# Altium schematic sheet Power.SchDoc
size A4
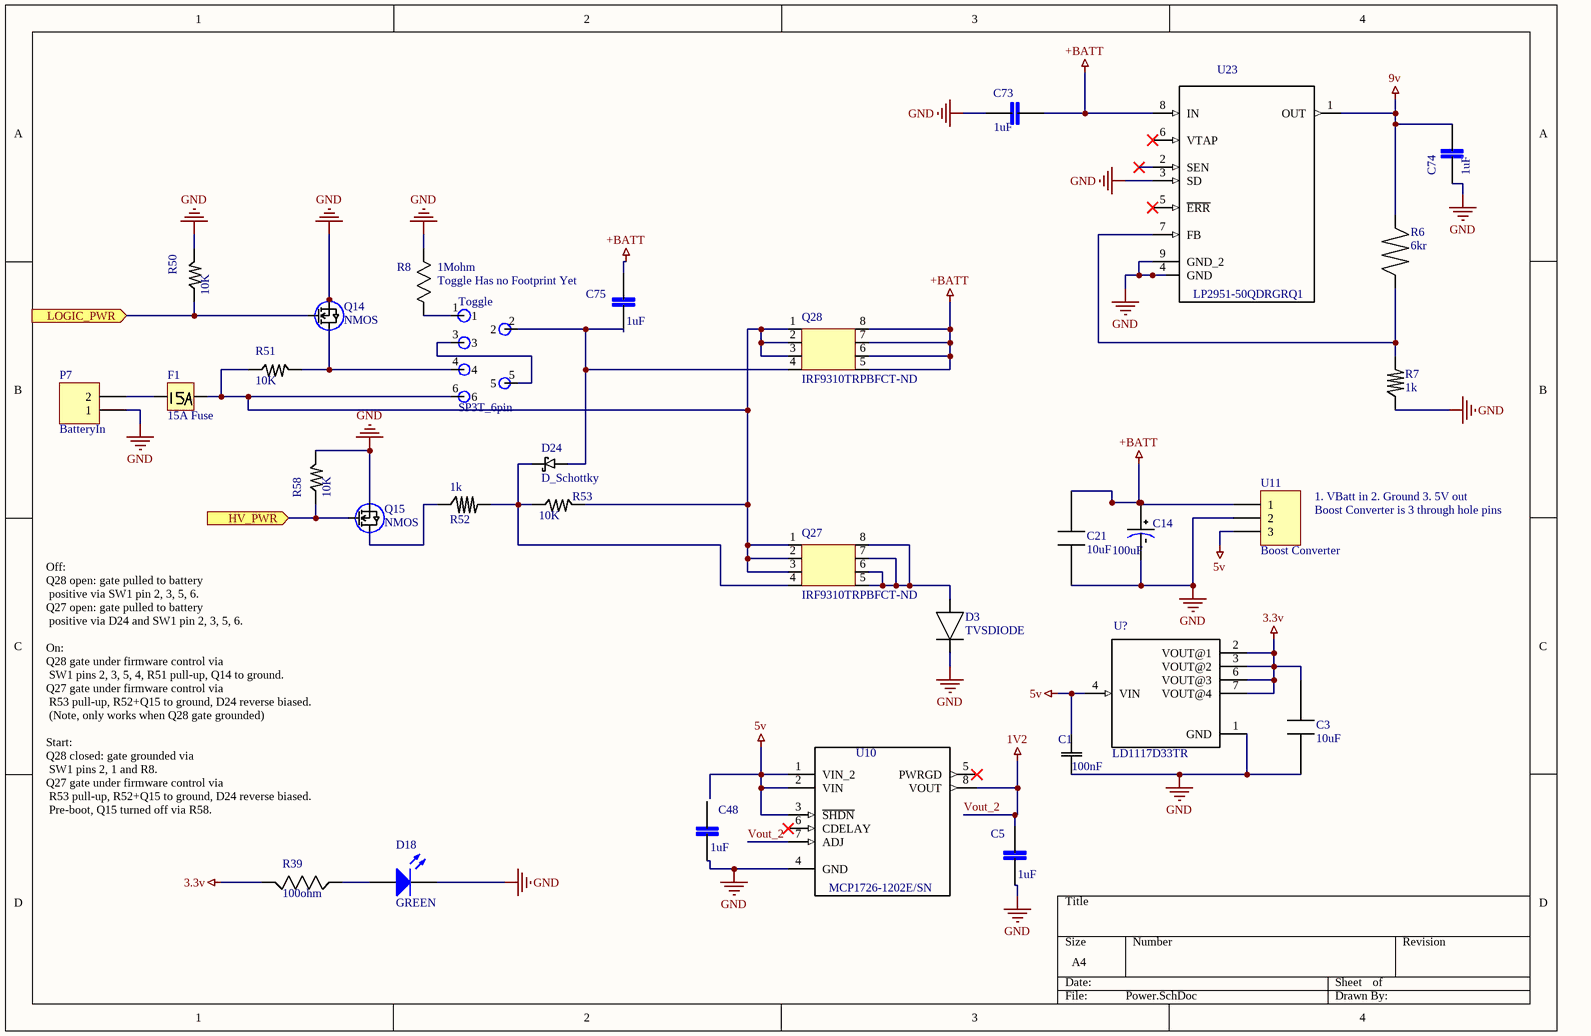
[diagram p0: Power.SchDoc]

## Parts
1k  R52  [CAPC2012X140N]
C1  100nF  [CAPC2013X110N]
C3  10uF  [CAPC3216X100N]
C5  1uF  [INDC2012X87N]
C14  100uF  [100uFCAPPRD350W60D800H1150B100uFECA-1HM101(Primary)]
C21  10uF  [CAPC3216X100N]
C48  1uF  [INDC2012X87N]
C73  1uF  [INDC2012X87N]
C74  1uF  [INDC2012X87N]
C75  1uF  [INDC2012X87N]
D3  TVSDIODE  [SODFL521X200-2N]
D18  GREEN  [3.2X1.6X1.1]
D24  D_Schottky
F1  15A Fuse  [1206]
P7  BatteryIn  [HDR1X2]
Q14  NMOS  [SOT95P230X110-3N]
Q15  NMOS  [SOT95P230X110-3N]
Q27  IRF9310TRPBFCT-ND  [SOIC127P600X175-8N]
Q28  IRF9310TRPBFCT-ND  [SOIC127P600X175-8N]
R6  6kr  [CAPM2012X05N]
R7  1k  [CAPC2012X140N]
R8  1Mohm  [RESC2013X65N]
R39  100ohm  [RESC2012X60]
R50  10K  [RESC2012X60]
R51  10K  [RESC2012X60]
R53  10K  [RESC2012X60]
R58  10K  [RESC2012X60]
Toggle  SP3T_6pin
U10  MCP1726-1202E/SN  [SOIC127P490X175-8N]
U11  Boost Converter  [HDR1X3]
U23  LP2951-50QDRGRQ1  [DFN400X400X80-9N]
U?  LD1117D33TR  [SOIC127P600X175-8N]

## Ports
HV_PWR (in), LOGIC_PWR (in)

## Nets
3.3v: R39.1 U?.2(VOUT@1) U?.3(VOUT@2) U?.6(VOUT@3) U?.7(VOUT@4)
5v: C1.2(C2) U10.1(VIN_2) U10.2(VIN) U10.3(~{SHDN}) U11.3 U?.4(VIN)
9v: C74.2 R6.2 U23.1(OUT)
+BATT: C14.POS C73.2 C75.2 Q28.5(D5) Q28.6(D6) Q28.7(D7) Q28.8(D8) U11.1 U23.8(IN)
GND: C1.1(C1) C5.1 C14.NEG C48.1 C73.1 C74.1 D3.1 D18.2(K) P7.1 Q14.2(Source) Q15.2(Source) R7.1 R8.1(R1) R50.2 R58.2 U10.4(GND) U11.2 U23.3(SD) U23.4(GND) U23.9(GND_2) U?.1(GND)
Vout_2: C5.2 U10.7(ADJ) U10.8(VOUT)  [also labelled 1V2]
HV_PWR: Q15.1(Gate) R58.1 ; port HV_PWR
LOGIC_PWR: Q14.1(Gate) R50.1 ; port LOGIC_PWR
Net1k_1: 1k.1 Q15.3(Drain)
Net1k_2: 1k.2 D24.1 Q27.4(G) R53.1
NetC75_1: C75.1 D24.2 Q28.4(G) Toggle.2
NetD3_1: D3.1 Q27.5(D5) Q27.6(D6) Q27.7(D7) Q27.8(D8)
NetD18_1: D18.1(A) R39.2
NetF1_1: F1.1 P7.2
NetF1_2: F1.2 Q27.1(S1) Q27.2(S2) Q27.3(S3) Q28.1(S1) Q28.2(S2) Q28.3(S3) R51.1 R53.2 Toggle.6
NetQ14_3: Q14.3(Drain) R51.2 Toggle.4
NetR6_1: R6.1 R7.2 U23.7(FB)
NetR8_2: R8.2(R2) Toggle.1
NetToggle_3: Toggle.3 Toggle.5

Not connected (* = marked no-connect by the designer): C3 In Out; C21 In Out; C48 2; U10 5(PWRGD)* 6(CDELAY)*; U23 2(SEN)* 5(~{ERR})* 6(VTAP)*

## Notes on the sheet
- (near R8) Toggle Has no Footprint Yet
- 1. VBatt in 2. Ground 3. 5V out
- Boost Converter is 3 through hole pins
- Off:
  Q28 open: gate pulled to battery
  positive via SW1 pin 2, 3, 5, 6.
  Q27 open: gate pulled to battery
  positive via D24 and SW1 pin 2, 3, 5, 6.
  On:
  Q28 gate under firmware control via
  SW1 pins 2, 3, 5, 4, R51 pull-up, Q14 to ground.
  Q27 gate under firmware control via
  R53 pull-up, R52+Q15 to ground, D24 reverse biased.
  (Note, only works when Q28 gate grounded)
  Start:
  Q28 closed: gate grounded via
  SW1 pins 2, 1 and R8.
  Q27 gate under firmware control via
  R53 pull-up, R52+Q15 to ground, D24 reverse biased.
  Pre-boot, Q15 turned off via R58.

## Library data of the parts
1k R7 = 1kohm: 1276-5272-1-ND
C1 = C0805C104K5RACTU: Capacitor; Ceramic; Cap; .100UF ; Tol+-10%; SMD; Vol-Rtg 50V; X7R, Tape/Reel; MF: Kemet; Package: 0805 Kemet; MP: C0805C104K5RACTU; Value: *
C3 C21 F1 = Component_1
C5 C48 C73-C75 = C2012X5R1E105M085AC: CAP CER 1UF 25V X5R 0805; MF: TDK; Package: 0805 TDK; MP: C2012X5R1E105M085AC; Value: *
C14 = ECA-1HM101: CAP ALUM 100UF 20% 50V RADIAL; MF: Panasonic; Package: Radial Panasonic; MP: ECA-1HM101; Value: *
D18 = LED2: Typical RED, GREEN, YELLOW, AMBER GaAs LED; Published: 8-Jun-2000; LatestRevisionDate: 17-Jul-2002; LatestRevisionNote: Re-released for DXP Platform.; PackageVersion: Feb-2002; PackageReference: 3.2X1.6X1.1; Publisher: Altium Limited; PackageDescription: SM LED; 2 Flat Leads
P7 = Header 2: Header, 2-Pin; LatestRevisionDate: 17-Jul-2002; LatestRevisionNote: Re-released for DXP Platform.; Publisher: Altium Limited
R8 = 1Mohm: RES SMD 1M OHM 1% 1/8W 0805; MP: RC0805FR-071ML; MF: Yageo; Digi-Key_Purchase_URL: https://www.digikey.ca/product-detail/en/yageo/RC0805FR-071ML/311-1.00MCRCT-ND/730392?WT.z_cid=ref_snapeda&utm_source=snapeda&utm_medium=aggregator&utm_campaign=buynow; Digi-Key_Part_Number: 311-1.00MCRCT-ND; Package: 0805 Yageo; Value: *
R39 = RC0805FR-07100RL: RES SMD 100 OHM 1% 1/8W 0805; MF: Yageo; MP: RC0805FR-07100RL; Package: 0805 Yageo; Value: *
R50 R51 R53 R58 = RC0805FR-0710KL: RES SMD 10K OHM 1% 1/8W 0805; MF: Yageo; Package: 0805 Yageo; MP: RC0805FR-0710KL; Value: *
U10 = MCP1726-1202E/SN: IC REG LINEAR 1.2V 1A 8SOIC; MF: Microchip; Package: SOIC-8 Microchip; MP: MCP1726-1202E/SN; Value: *
U11 = Header 3: Header, 3-Pin; LatestRevisionDate: 17-Jul-2002; LatestRevisionNote: Re-released for DXP Platform.; Publisher: Altium Limited
U23 = LP2951-50QDRGRQ1: IC REG LIN POS ADJ 100MA 8SON; MF: Texas Instruments; Package: SON-8 Texas Instruments; MP: LP2951-50QDRGRQ1; Value: *
U? = LD1117D33TR: IC REG LINEAR 3.3V 800MA 8SO; MF: STMicroelectronics; Package: SO-8 STMicroelectronics; MP: LD1117D33TR; Value: *